# Altium schematic sheet beagle_bone_cape.SchDoc
size A4
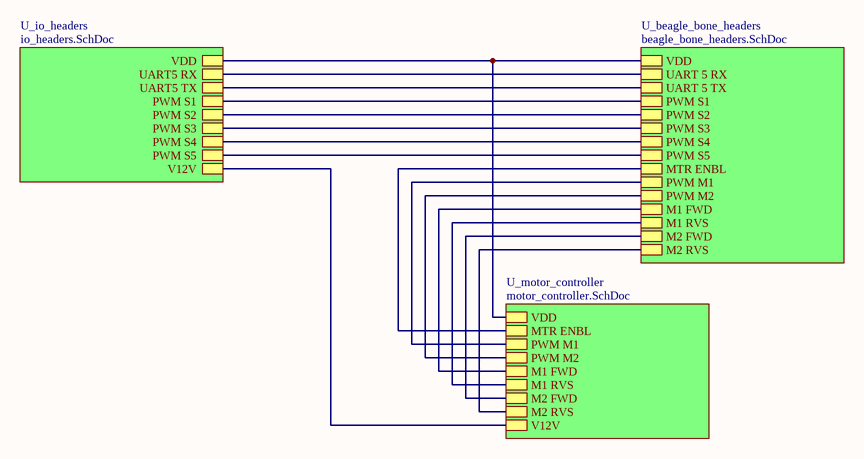
[diagram p0: beagle_bone_cape.SchDoc]

## Sub-sheets
U_beagle_bone_headers = beagle_bone_headers.SchDoc: VDD, PWM S1, PWM S2, PWM S3, PWM S4, PWM S5, PWM M1, PWM M2, UART 5 RX, UART 5 TX, M2 FWD, M1 FWD, M1 RVS, M2 RVS, MTR ENBL
U_io_headers = io_headers.SchDoc: V12V, VDD, PWM S1, PWM S2, PWM S3, PWM S4, PWM S5, UART5 TX, UART5 RX
U_motor_controller = motor_controller.SchDoc: VDD, MTR ENBL, PWM M1, PWM M2, M1 FWD, M1 RVS, M2 FWD, M2 RVS, V12V

## Nets
(unnamed): sheet U_beagle_bone_headers/VDD, sheet U_io_headers/VDD, sheet U_motor_controller/VDD
(unnamed): sheet U_beagle_bone_headers/PWM S1, sheet U_io_headers/PWM S1
(unnamed): sheet U_beagle_bone_headers/PWM S2, sheet U_io_headers/PWM S2
(unnamed): sheet U_beagle_bone_headers/PWM S3, sheet U_io_headers/PWM S3
(unnamed): sheet U_beagle_bone_headers/PWM S4, sheet U_io_headers/PWM S4
(unnamed): sheet U_beagle_bone_headers/PWM S5, sheet U_io_headers/PWM S5
(unnamed): sheet U_beagle_bone_headers/PWM M1, sheet U_motor_controller/PWM M1
(unnamed): sheet U_beagle_bone_headers/PWM M2, sheet U_motor_controller/PWM M2
(unnamed): sheet U_beagle_bone_headers/UART 5 RX, sheet U_io_headers/UART5 RX
(unnamed): sheet U_beagle_bone_headers/UART 5 TX, sheet U_io_headers/UART5 TX
(unnamed): sheet U_beagle_bone_headers/M2 FWD, sheet U_motor_controller/M2 FWD
(unnamed): sheet U_beagle_bone_headers/M1 FWD, sheet U_motor_controller/M1 FWD
(unnamed): sheet U_beagle_bone_headers/M1 RVS, sheet U_motor_controller/M1 RVS
(unnamed): sheet U_beagle_bone_headers/M2 RVS, sheet U_motor_controller/M2 RVS
(unnamed): sheet U_beagle_bone_headers/MTR ENBL, sheet U_motor_controller/MTR ENBL
(unnamed): sheet U_io_headers/V12V, sheet U_motor_controller/V12V